# EAGLE schematic twiigs (EAGLE 7.5.0)
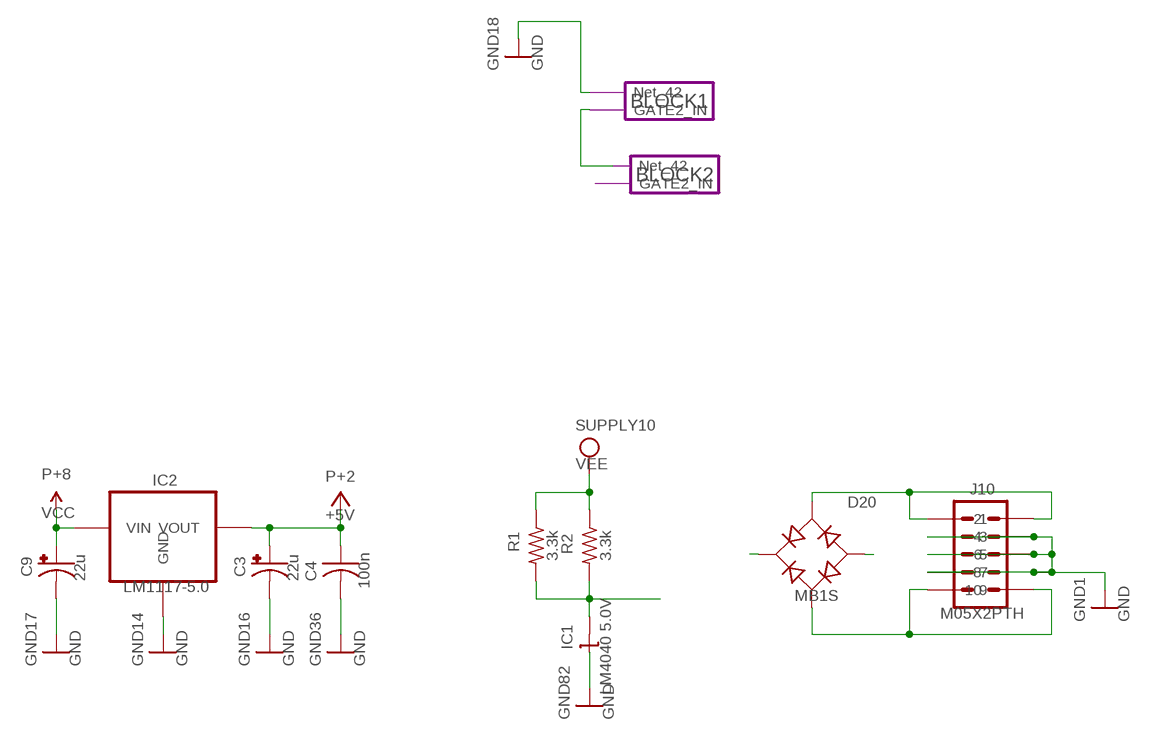
[diagram p0: schematic, sheet 1]

## Parts
C3  22u  CPOL-USC  [PANASONIC_C]
C4  100n  C-USC0603  [CAP_0603]
C9  22u  CPOL-USC  [PANASONIC_C]
D20  MB1S  [SOP-4/6.5x2.54]
IC1  LM4040 5.0V  LM4041C12DBZ  [DBZ_R-PDSO-G3]
IC2  LM1117-5.0  REG1117  [SOT223]
J10  M05X2PTH  [AVR_ICSP]
R1  3.3k  R-US_R0603  [RES_0603]
R2  3.3k  R-US_R0603  [RES_0603]

## Module instances
BLOCK1 = BRANCHES
BLOCK2 = BRANCHES

## Nets
+5V: C3.+ C4.1 IC2.2(VOUT)
GND: C3.- C4.2 C9.- IC1.1(C) IC2.1(GND) J10.3 J10.4 J10.5 J10.6 J10.7 J10.8 ; port Block1.Net_42
Net_0: D20.3(AC2) J10.1 J10.2
Net_43: port Block1.GATE2_IN Block2.Net_42
Net_44: D20.4(AC1) J10.9 J10.10
REF_-5: IC1.2(A) R1.2 R2.2
VCC: C9.+ D20.1(+) IC2.3(VIN)
VEE: D20.2(-) R1.1 R2.1

## Library data of the parts
C3 C9 = common:CPOL-USC
C4 = common:C-USC0603
D20 = common:MB1S
IC1 = common:LM4041C12DBZ
IC2 = common:REG1117
J10 = common:M05X2PTH
R1 R2 = common:R-US_R0603

## Module BRANCHES
Ports: Net_42(io) GATE2_IN(io)
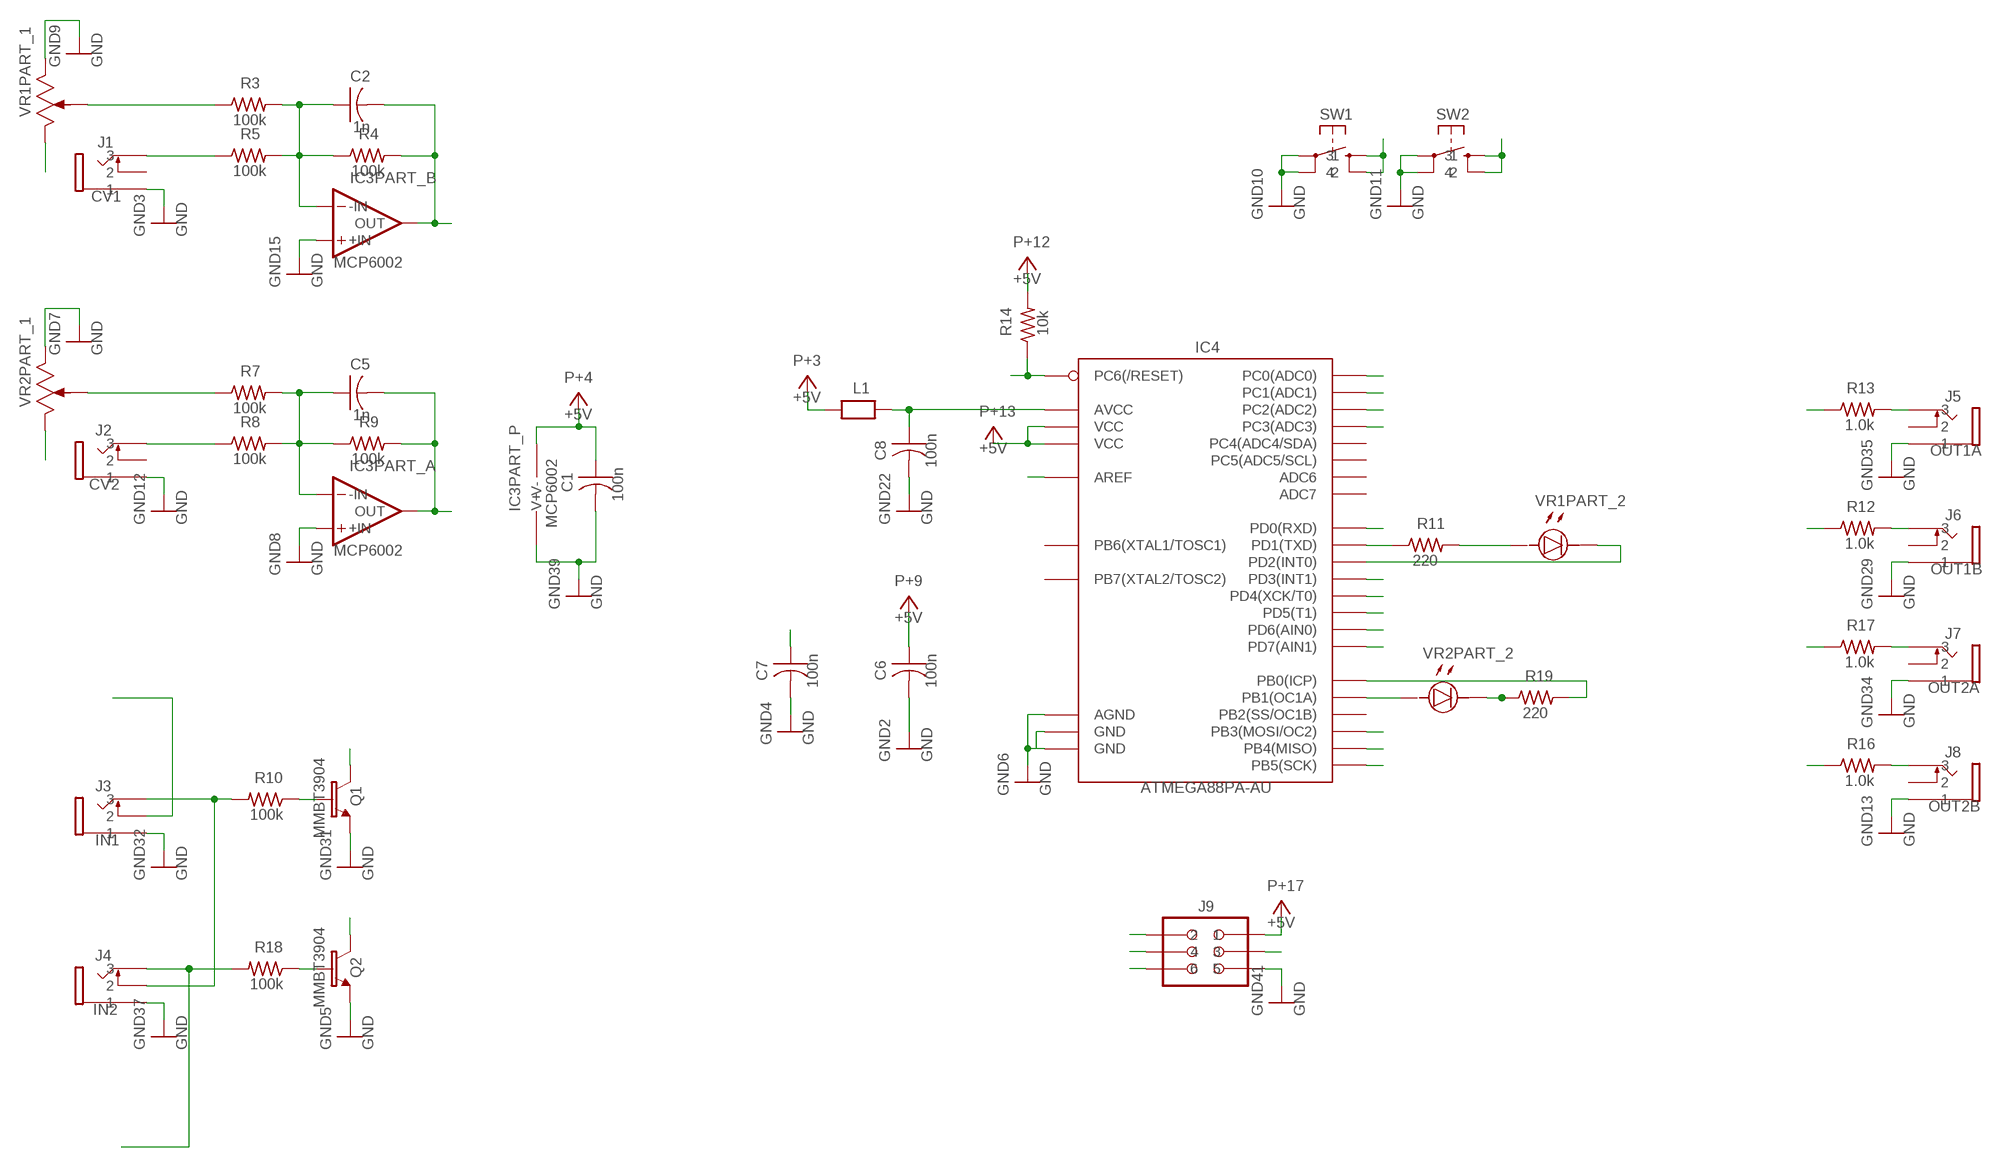
[diagram p1: schematic, module BRANCHES, sheet 1]

### Parts
C1  100n  C-USC0603  [CAP_0603]
C2  1n  C-USC0603_5  [CAP_0603]
C5  1n  C-USC0603_5  [CAP_0603]
C6  100n  C-USC0603  [CAP_0603]
C7  100n  C-USC0603  [CAP_0603]
C8  100n  C-USC0603  [CAP_0603]
IC3  MCP6002  [SO08]
IC4  ATMEGA88PA-AU  ATMEGA168  [TQFP32-08]
J1  CV1  PJ301_THONKICONN6  [Thonkiconn]
J2  CV2  DEV50  [Thonkiconn]
J3  IN1  PJ301_THONKICONN6  [Thonkiconn]
J4  IN2  PJ301_THONKICONN6  [Thonkiconn]
J5  OUT1A  PJ301_THONKICONN6_1  [Thonkiconn]
J6  OUT1B  PJ301_THONKICONN6_1  [Thonkiconn]
J7  OUT2A  PJ301_THONKICONN6_1  [Thonkiconn]
J8  OUT2B  PJ301_THONKICONN6_1  [Thonkiconn]
J9  AVR_SPI_PRG_6PTH  [HDR-2x3S/2.54x2.54/Sh15x11]
L1  WE-CBF_0603  [0603]
Q1  MMBT3904  MMBT3904LT1-NPN-SOT23-BEC  [SOT23-BEC]
Q2  MMBT3904  MMBT3904LT1-NPN-SOT23-BEC  [SOT23-BEC]
R3  100k  R-US_R0603_9  [RES_0603]
R4  100k  R-US_R0603_9  [RES_0603]
R5  100k  R-US_R0603_9  [RES_0603]
R7  100k  R-US_R0603_9  [RES_0603]
R8  100k  R-US_R0603_9  [RES_0603]
R9  100k  R-US_R0603_9  [RES_0603]
R10  100k  R-US_R0603_10  [RES_0603]
R11  220  R-US_R0603_9  [RES_0603]
R12  1.0k  R-US_R0603_9  [RES_0603]
R13  1.0k  R-US_R0603_9  [RES_0603]
R14  10k  R-US_R0603_11  [RES_0603]
R16  1.0k  R-US_R0603_9  [RES_0603]
R17  1.0k  R-US_R0603_9  [RES_0603]
R18  100k  R-US_R0603_10  [RES_0603]
R19  220  R-US_R0603_9  [RES_0603]
SW1  TAC_SWITCHPTH  [TACTILE-PTH]
SW2  TAC_SWITCHPTH  [TACTILE-PTH]
VR1  BOURNS_PTL_LED_SLIDE_POT  [BOURNS_PTL_30mm]
VR2  BOURNS_PTL_LED_SLIDE_POT  [BOURNS_PTL_30mm]

### Nets
+5V: C1.1 C6.1 IC3.8(PART_P:V+) IC4.4(VCC) IC4.6(VCC) J9.2 L1.1 R14.2
AREF: C7.1 IC4.20(AREF)
GATE1_IN: J3.2 J4.1 R10.2
GATE2_IN: J4.2 R18.2
GND: C1.2 C6.2 C7.2 C8.2 IC3.3(PART_A:+IN) IC3.4(PART_P:V-) IC3.5(PART_B:+IN) IC4.3(GND) IC4.5(AGND) IC4.21(GND) J1.3 J2.3 J3.3 J4.3 J5.3 J6.3 J7.3 J8.3 J9.6 Q1.E Q2.E SW1.1 SW1.2 SW2.1 SW2.2 VR1.3(PART_1:CW) VR2.3(PART_1:CW)
IN1: IC4.2(PD4(XCK/T0)) Q1.C
IN2: IC4.11(PD7(AIN1)) Q2.C
MISO: IC4.16(PB4(MISO)) J9.1
MOSI: IC4.15(PB3(MOSI/OC2)) J9.4
N$1: Q1.B R10.1
N$2: Q2.B R18.1
N$4: C5.1 IC3.2(PART_A:-IN) R7.2 R8.2 R9.1
N$6: J8.2 R16.2
N$8: R7.1 VR2.2(PART_1:W)
N$9: R3.1 VR1.2(PART_1:W)
N$10: J1.2 R5.1
N$11: J2.2 R8.1
N$13: IC4.31(PD1(TXD)) R11.1
N$14: R11.2 VR1.5(PART_2:gnd)
N$15: IC4.32(PD2(INT0)) VR1.6(PART_2:gnd)
N$16: IC4.13(PB1(OC1A)) VR2.5(PART_2:gnd)
N$17: R19.1 VR2.6(PART_2:gnd)
N$18: IC4.12(PB0(ICP)) R19.2
N$29: C2.1 IC3.6(PART_B:-IN) R3.2 R4.1 R5.2
N$34: J5.2 R13.2
N$35: J6.2 R12.2
N$36: J7.2 R17.2
N$39: C8.1 IC4.18(AVCC) L1.2
Net_42: J3.1
OUT1_A: IC4.1(PD3(INT1)) R13.1
OUT1_B: IC4.30(PD0(RXD)) R12.1
OUT2_A: IC4.10(PD6(AIN0)) R17.1
OUT2_B: IC4.9(PD5(T1)) R16.1
P1_CV: C2.2 IC3.7(PART_B:OUT) IC4.24(PC1(ADC1)) R4.2
P2_CV: C5.2 IC3.1(PART_A:OUT) IC4.23(PC0(ADC0)) R9.2
REF_-5: VR1.1(PART_1:CCW) VR2.1(PART_1:CCW)
RESET: IC4.29(PC6(/RESET)) J9.5 R14.1
SCK: IC4.17(PB5(SCK)) J9.3
SW1: IC4.26(PC3(ADC3)) SW1.3 SW1.4
SW2: IC4.25(PC2(ADC2)) SW2.3 SW2.4
Unconnected: IC4.7(PB6(XTAL1/TOSC1)) IC4.8(PB7(XTAL2/TOSC2)) IC4.14(PB2(SS/OC1B)) IC4.19(ADC6) IC4.22(ADC7) IC4.27(PC4(ADC4/SDA)) IC4.28(PC5(ADC5/SCL)) J1.1 J2.1 J5.1 J6.1 J7.1 J8.1

### Library data of the parts
C1 C6-C8 = common:C-USC0603
C2 C5 = common:C-USC0603_5
IC3 = common:MCP6002
IC4 = common:ATMEGA168
J1 = common:PJ301_THONKICONN6
J2 = common:DEV50
J3 J4 = common:PJ301_THONKICONN6; VALUE: CV1
J5 = common:PJ301_THONKICONN6_1
J6-J8 = common:PJ301_THONKICONN6_1; VALUE: OUT1A
J9 = common:AVR_SPI_PRG_6PTH
L1 = common:WE-CBF_0603
Q1 Q2 = common:MMBT3904LT1-NPN-SOT23-BEC
R3-R5 R7-R9 = common:R-US_R0603_9
R10 R18 = common:R-US_R0603_10
R11-R13 R16 R17 R19 = common:R-US_R0603_9; VALUE: 100k
R14 = common:R-US_R0603_11
SW1 SW2 = common:TAC_SWITCHPTH
VR1 VR2 = common:BOURNS_PTL_LED_SLIDE_POT; DATASHEET: http://www.bourns.com/data/global/pdfs/bourns_trimpot_catalog.pdf; MANUFACTURER: Bourns